# Altium schematic sheet SoundChip.SchDoc
size A
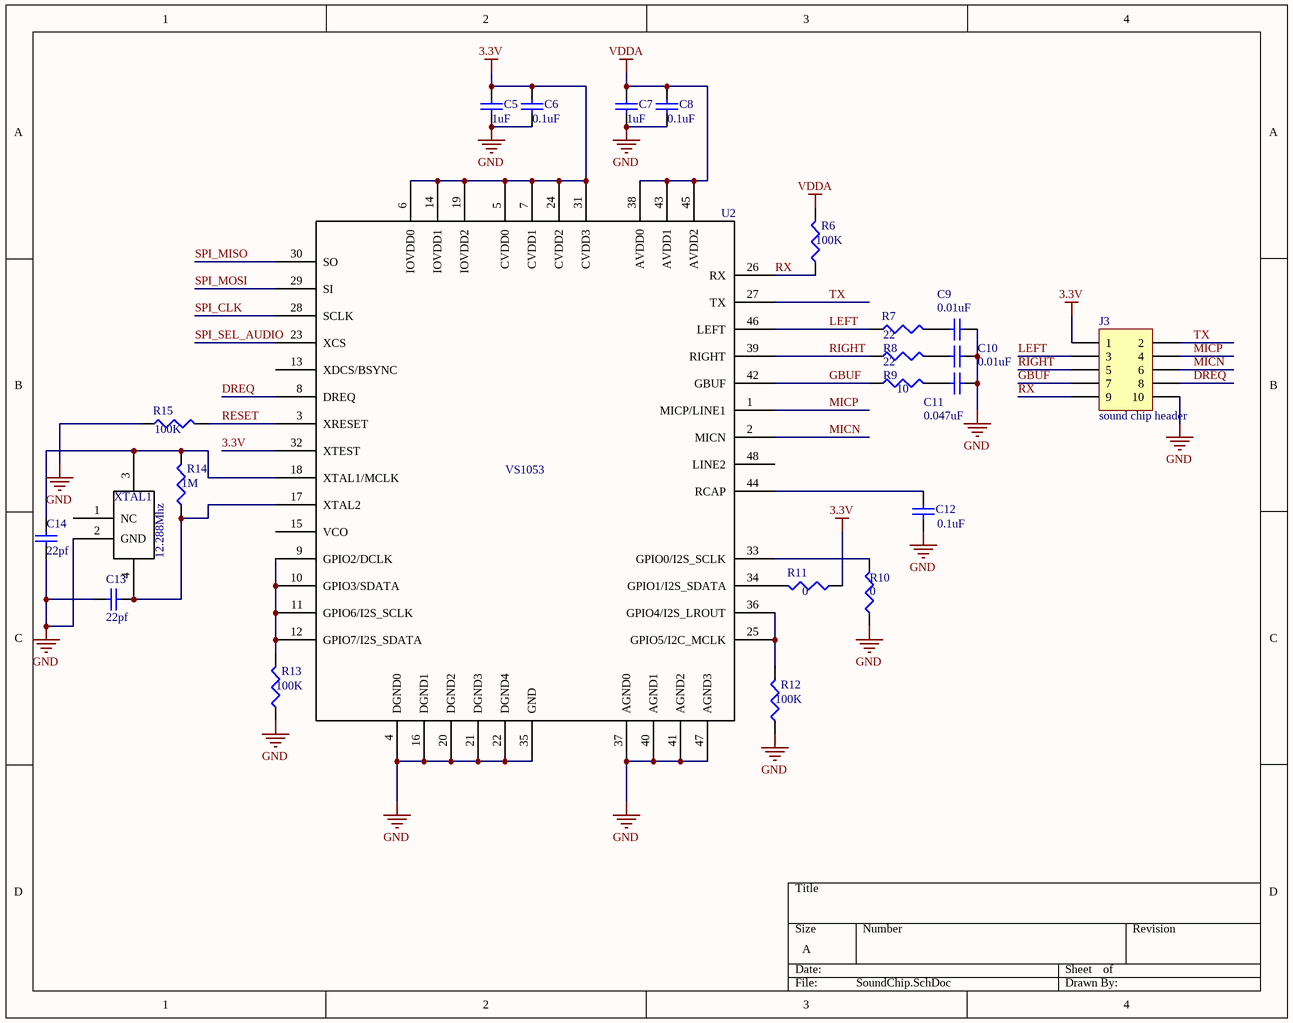
[diagram p0: SoundChip.SchDoc]

## Parts
C5  value 1uF  [CAPC1608L]  (hidden comment: Cap Semi)
C6  value 0.1uF  [CAPC1005L]  (hidden comment: Cap Semi)
C7  value 1uF  [CAPC1608L]  (hidden comment: Cap Semi)
C8  value 0.1uF  [CAPC1005L]  (hidden comment: Cap Semi)
C9  value 0.01uF  [CAPC1005L]  (hidden comment: Cap Semi)
C10  value 0.01uF  [CAPC1005L]  (hidden comment: Cap Semi)
C11  value 0.047uF  [CAPC1005L]  (hidden comment: Cap Semi)
C12  value 0.1uF  [CAPC3216L]  (hidden comment: Cap Semi)
C13  value 22pf  [CAPC1005L]  (hidden comment: Cap Semi)
C14  value 22pf  [CAPC1005L]  (hidden comment: Cap Semi)
J3  sound chip header  [HDR2X5]
R6  value 100K  [RESC1608L]  (hidden comment: Res3)
R7  value 22  [RESC1608L]  (hidden comment: Res3)
R8  value 22  [RESC1608L]  (hidden comment: Res3)
R9  value 10  [RESC1608L]  (hidden comment: Res3)
R10  value 0  [RESC1608L]  (hidden comment: Res3)
R11  value 0  [RESC1608L]  (hidden comment: Res3)
R12  value 100K  [RESC1608L]  (hidden comment: Res3)
R13  value 100K  [RESC1608L]  (hidden comment: Res3)
R14  value 1M  [RESC1608L]  (hidden comment: Res3)
R15  value 100K  [RESC1608L]  (hidden comment: Res3)
U2  VS1053  [LQFP-48]
XTAL1  12.288Mhz  [Crystal]

## Nets
3.3V: C5.1 C6.2 J3.1 R11.1 U2.5(CVDD0) U2.6(IOVDD0) U2.7(CVDD1) U2.14(IOVDD1) U2.19(IOVDD2) U2.24(CVDD2) U2.31(CVDD3) U2.32(XTEST)
GND: C5.2 C6.1 C7.2 C8.1 C9.2 C10.2 C11.2 C12.1 C13.2 C14.1 J3.10 R10.1 R12.1 R13.1 R15.1 U2.4(DGND0) U2.16(DGND1) U2.20(DGND2) U2.21(DGND3) U2.22(DGND4) U2.35(GND) U2.37(AGND0) U2.40(AGND1) U2.41(AGND2) U2.47(AGND3) XTAL1.2(GND)
VDDA: C7.1 C8.2 R6.2 U2.38(AVDD0) U2.43(AVDD1) U2.45(AVDD2)
DREQ: J3.8 U2.8(DREQ)
GBUF: J3.7 R9.1 U2.42(GBUF)
LEFT: J3.3 R7.1 U2.46(LEFT)
MICN: J3.6 U2.2(MICN)
MICP: J3.4 U2.1(MICP/LINE1)
RESET: R15.2 U2.3(XRESET)
RIGHT: J3.5 R8.1 U2.39(RIGHT)
RX: J3.9 R6.1 U2.26(RX)
SPI_CLK: U2.28(SCLK)
SPI_MISO: U2.30(SO)
SPI_MOSI: U2.29(SI)
SPI_SEL_AUDIO: U2.23(XCS)
TX: J3.2 U2.27(TX)
NetC9_1: C9.1 R7.2
NetC10_1: C10.1 R8.2
NetC11_1: C11.1 R9.2
NetC12_2: C12.2 U2.44(RCAP)
NetC13_1: C13.1 R14.1 U2.17(XTAL2) XTAL1.4
NetC14_2: C14.2 R14.2 U2.18(XTAL1/MCLK) XTAL1.3
NetR10_2: R10.2 U2.33(GPIO0/I2S_SCLK)
NetR11_2: R11.2 U2.34(GPIO1/I2S_SDATA)
NetR12_2: R12.2 U2.25(GPIO5/I2C_MCLK) U2.36(GPIO4/I2S_LROUT)
NetR13_2: R13.2 U2.9(GPIO2/DCLK) U2.10(GPIO3/SDATA) U2.11(GPIO6/I2S_SCLK) U2.12(GPIO7/I2S_SDATA)

Not connected (* = marked no-connect by the designer): U2 13(XDCS/BSYNC) 15(VCO) 48(LINE2); XTAL1 1(NC)

## Library data of the parts
C5-C14 = Cap Semi: Capacitor (Semiconductor SIM Model); Published: 8-Jun-2000; LatestRevisionDate: 29-May-2009; LatestRevisionNote: IPC-7351 Footprint Added.; PackageReference: C1206; Publisher: Altium Limited; PackageDescription: Chip Capacitor
J3 = Header 5X2: Header, 5-Pin, Dual row; LatestRevisionDate: 17-Jul-2002; LatestRevisionNote: Re-released for DXP Platform.; Publisher: Altium Limited
R6-R15 = Res3: Resistor; Published: 8-Jun-2000; LatestRevisionDate: 29-May-2009; LatestRevisionNote: IPC-7351 Footprint Added.; PackageReference: J1-0603; Publisher: Altium Limited; PackageDescription: Chip Resistor
XTAL1 = SoundCrystal: FOX924B crystal